# Altium project 243-TGE-Template.PrjPcb
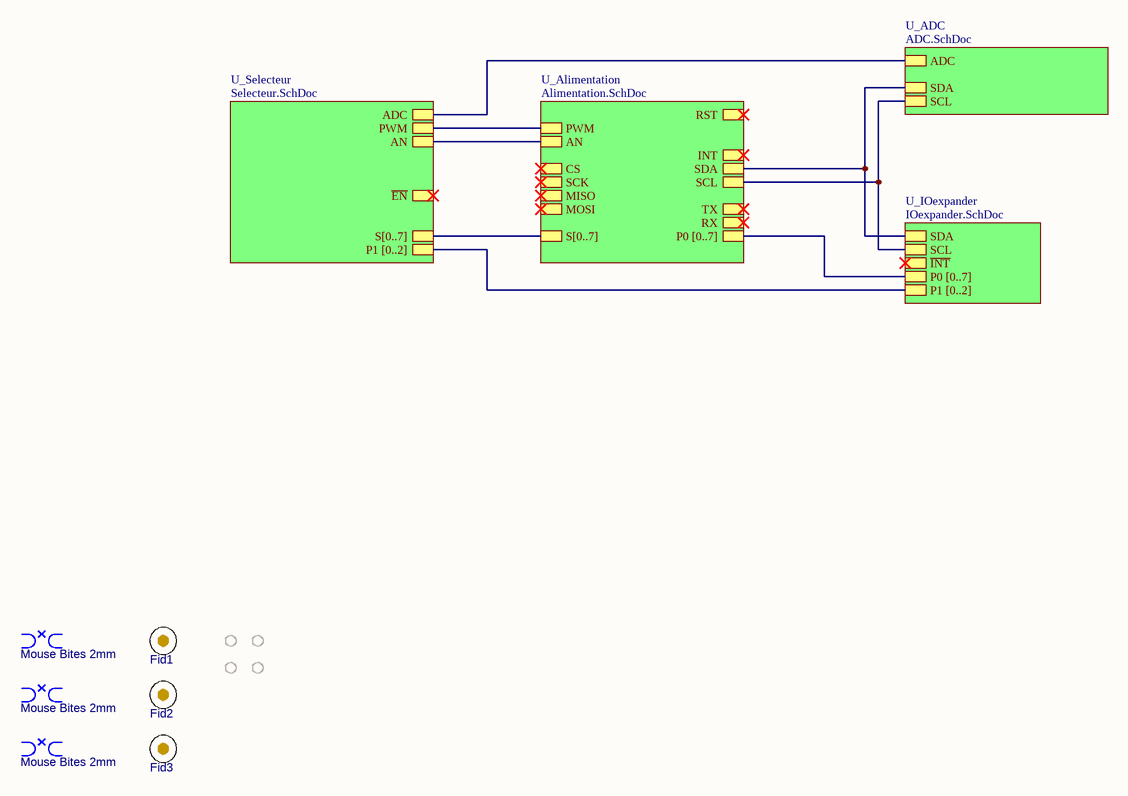
[diagram p0: Page_Tete.SchDoc]
NomDeLetudiant: Le nom de l'étudiant; NomDeProjet: Le nom de mon Projet; Revision: La Revision
5 sheets, 52 parts. Net scope: hierarchical (ports join the sheet entries above them; power ports are global).
Board file: ClickBoard.PcbDoc
Sheets:
  Page_Tete.SchDoc
    U_ADC = ADC.SchDoc
    U_Alimentation = Alimentation.SchDoc
    U_Selecteur = Selecteur.SchDoc
    U_IOexpander = IOexpander.SchDoc

## Sheet Page_Tete.SchDoc: ClickBoard - Page Tête
size Letter; ApprovedBy: K.C.; Author: Antoine Perron; Organization: Cegep Limoilou; Address1: 1300, 8e Avenue; Address2: Québec, QC; Address3: Canada; Address4: G1J 5L5; Revision: B2; SheetNumber: 1; SheetTotal: 5

### Parts
BRK1  value Mouse Bites 2mm  [BK_CRACK1B_M]  (hidden comment: DNP)  (no BOM)
BRK2  value Mouse Bites 2mm  [BK_CRACK1B_M]  (hidden comment: DNP)  (no BOM)
BRK3  value Mouse Bites 2mm  [BK_CRACK1B_M]  (hidden comment: DNP)  (no BOM)
Fid1  DNP  [FD_Fiducial]  (value not drawn)  (no BOM)
Fid2  DNP  [FD_Fiducial]  (value not drawn)  (no BOM)
Fid3  DNP  [FD_Fiducial]  (value not drawn)  (no BOM)
MH1  DNP  [MP_M-Hole_M2-NonPlated]  (value not drawn)  (no BOM)
MH2  DNP  [MP_M-Hole_M2-NonPlated]  (value not drawn)  (no BOM)
MH3  DNP  [MP_M-Hole_M2-NonPlated]  (value not drawn)  (no BOM)
MH4  DNP  [MP_M-Hole_M2-NonPlated]  (value not drawn)  (no BOM)

### Sub-sheets
U_ADC = ADC.SchDoc: SCL, SDA, ADC
U_Alimentation = Alimentation.SchDoc: SDA, SCL, S[0..7], P0 [0..7], MOSI, MISO, SCK, RST, PWM, CS, AN, RX, TX, INT
U_IOexpander = IOexpander.SchDoc: SDA, SCL, ~{INT}, P0 [0..7], P1 [0..2]
U_Selecteur = Selecteur.SchDoc: ADC, ~{EN}, PWM, P1 [0..2], S[0..7], AN

### Nets
ADC: sheet U_ADC/ADC, sheet U_Selecteur/ADC
AN: sheet U_Alimentation/AN, sheet U_Selecteur/AN
PWM: sheet U_Alimentation/PWM, sheet U_Selecteur/PWM
SCL: sheet U_ADC/SCL, sheet U_Alimentation/SCL, sheet U_IOexpander/SCL
SDA: sheet U_ADC/SDA, sheet U_Alimentation/SDA, sheet U_IOexpander/SDA

Not connected (* = marked no-connect by the designer): BRK1 1 2 3 4 5; BRK2 1 2 3 4 5; BRK3 1 2 3 4 5; Fid1 1 2 3 4 5; Fid2 1 2 3 4 5; Fid3 1 2 3 4 5

### Buses and harness runs
bus sheet U_Alimentation/P0 [0..7] = sheet U_IOexpander/P0 [0..7]
bus sheet U_Alimentation/S[0..7] = sheet U_Selecteur/S[0..7]
bus sheet U_IOexpander/P1 [0..2] = sheet U_Selecteur/P1 [0..2]

### Notes on the sheet
- Titre :
- Conception :
- Date :
- Approbation :
- Heure :
- Révision :
- Feuille
- de
- Fichier :

### Library data of the parts
BRK1-BRK3 = BK_BREAKOUT_2MM: Mouse Bites; Mounting Technology: N/A
Fid1-Fid3 = Fiducial: Fiducial mark for alignement and Pick&Place; Value: Fiducial mark; Mounting Technology: N/A
MH1-MH4 = MH-2MM_NP: Mounting Hole 2mm non plated; Manufacturer Part Number 1: DNP; Mounting Technology: N/A; Value: Mounting Hole 2mm non plated; Supplier Part Number 1: N/A

## Sheet ADC.SchDoc: ClickBoard - ADC
size Letter; ApprovedBy: K.C.; Author: Antoine Perron; Organization: Cegep Limoilou; Address1: 1300, 8e Avenue; Address2: Québec, QC; Address3: Canada; Address4: G1J 5L5; Revision: B3; SheetNumber: 3; SheetTotal: 5
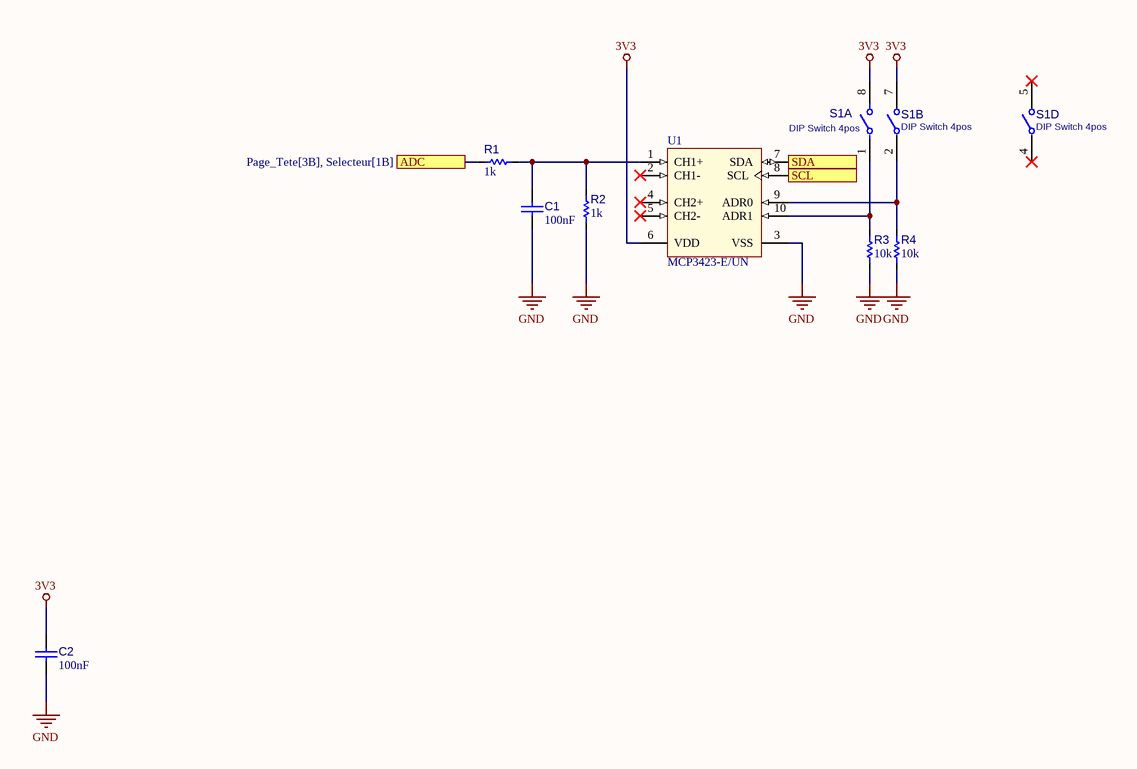
[diagram p1: ADC.SchDoc]

### Parts
C1  value 100nF  [C_1608[0603]]  (hidden comment: CAP CER 100nF 50V 0603)
C2  value 100nF  [C_1608[0603]]  (hidden comment: CAP CER 100nF 50V 0603)
R1  value 1k  [R_1608[0603]]  (hidden comment: Res 1k 1% 0603)
R2  value 1k  [R_1608[0603]]  (hidden comment: Res 1k 1% 0603)
R3  value 10k  [R_1608[0603]]  (hidden comment: Res 10k 1% 0603)
R4  value 10k  [R_1608[0603]]  (hidden comment: Res 10k 1% 0603)
S1  value DIP Switch 4pos  [S_DIP_SWITCH_50MIL_4POS]  (hidden comment: DSHP04TSGER)  (parts A,B,D of 4)
U1  MCP3423-E/UN  [U_MSOP50P300X500-10(RM-10)_WO-TP]

### Ports
ADC (see Page_Tete[3B], Selecteur[1B]), SCL (see Page_Tete[3B], Alimentation[4B], IOexpander[2B]), SDA (see Page_Tete[3B], Alimentation[4B], IOexpander[2B])

### Nets
3V3: C2.2 S1.7 S1.8 U1.6(VDD)
GND: C1.1 C2.1 R2.1 R3.1 R4.1 U1.3(VSS)
ADC: R1.1 ; port ADC
SCL: U1.8(SCL) ; port SCL
SDA: U1.7(SDA) ; port SDA
NetC1_2: C1.2 R1.2 R2.2 U1.1(CH1+)
NetR3_2: R3.2 S1.1 U1.10(ADR1)
NetR4_2: R4.2 S1.2 U1.9(ADR0)

Not connected (* = marked no-connect by the designer): S1 4* 5*; U1 2(CH1-)* 4(CH2+)* 5(CH2-)*

### Notes on the sheet
- Titre :
- Conception :
- Date :
- Approbation :
- Heure :
- Révision :
- Feuille
- de
- Fichier :

### Library data of the parts
C1 C2 = CAP002: Capacitor type 1; Manufacturer 1: Yageo; Manufacturer Part Number 1: CC0603KRX7R9BB104; LibRef: CAP002; Code CEGEP: COND0143SM; Tolerance: 10%; Dielectric: X7R; Rated Voltage: 50V; Mounting Technology: SMT; Supplier 1: LCSC; Supplier Part Number 1: C14663
R1 R2 = RES015: Resistor type 1; Manufacturer 1: Yageo; Manufacturer Part Number 1: RC0603FR-071KL; LibRef: RES015; Puissance: 1/10W; Max Working Voltage: 75V; Tolerance: 1%; Mounting Technology: SMT; Supplier 1: LCSC; Supplier Part Number 1: C22548
R3 R4 = RES001: Resistor type 1; Manufacturer 1: Yageo; Manufacturer Part Number 1: RC0603FR-0710KL; LibRef: RES001; Code CEGEP: RESI0238-0603; Puissance: 1/10W; Max Working Voltage: 75V; Tolerance: 1%; Mounting Technology: SMT; Supplier 1: LCSC; Supplier Part Number 1: C98220
S1 = SW_DIP_50MIL_4POS: SWITCH DIP SLIDE SPST 25MA 24V, pitch 1.27mm, height 1.55mm; Manufacturer 1: kangshen; Manufacturer 2: Omron; Manufacturer Part Number 1: DSHP04TSGER; Manufacturer Part Number 2: A6H-4102-PM; Mounting Technology: SMT; Supplier 1: LCSC; Supplier 2: LCSC; Supplier Part Number 1: C3293144; Supplier Part Number 2: C2733274; Supplier 3: Digikey; Supplier Part Number 3: 39-A6H-4102-PMCT-ND
U1 = U_MCP3423-E/UN: CAN Controller Stand-Alone With SPI, 18-Pin PDIP; Manufacturer 1: Microchip; Manufacturer Part Number 1: MCP3423-E/UN; Supplier 1: LCSC; Supplier Part Number 1: C220864; Mounting Technology: SMT; Supplier 2: Digikey; Supplier Part Number 2: MCP3423-E/UN-ND

## Sheet Alimentation.SchDoc: ClickBoard - Alimentation
size Letter; ApprovedBy: K.C.; Author: Antoine Perron; Organization: Cegep Limoilou; Address1: 1300, 8e Avenue; Address2: Québec, QC; Address3: Canada; Address4: G1J 5L5; Revision: B3; SheetNumber: 2; SheetTotal: 5
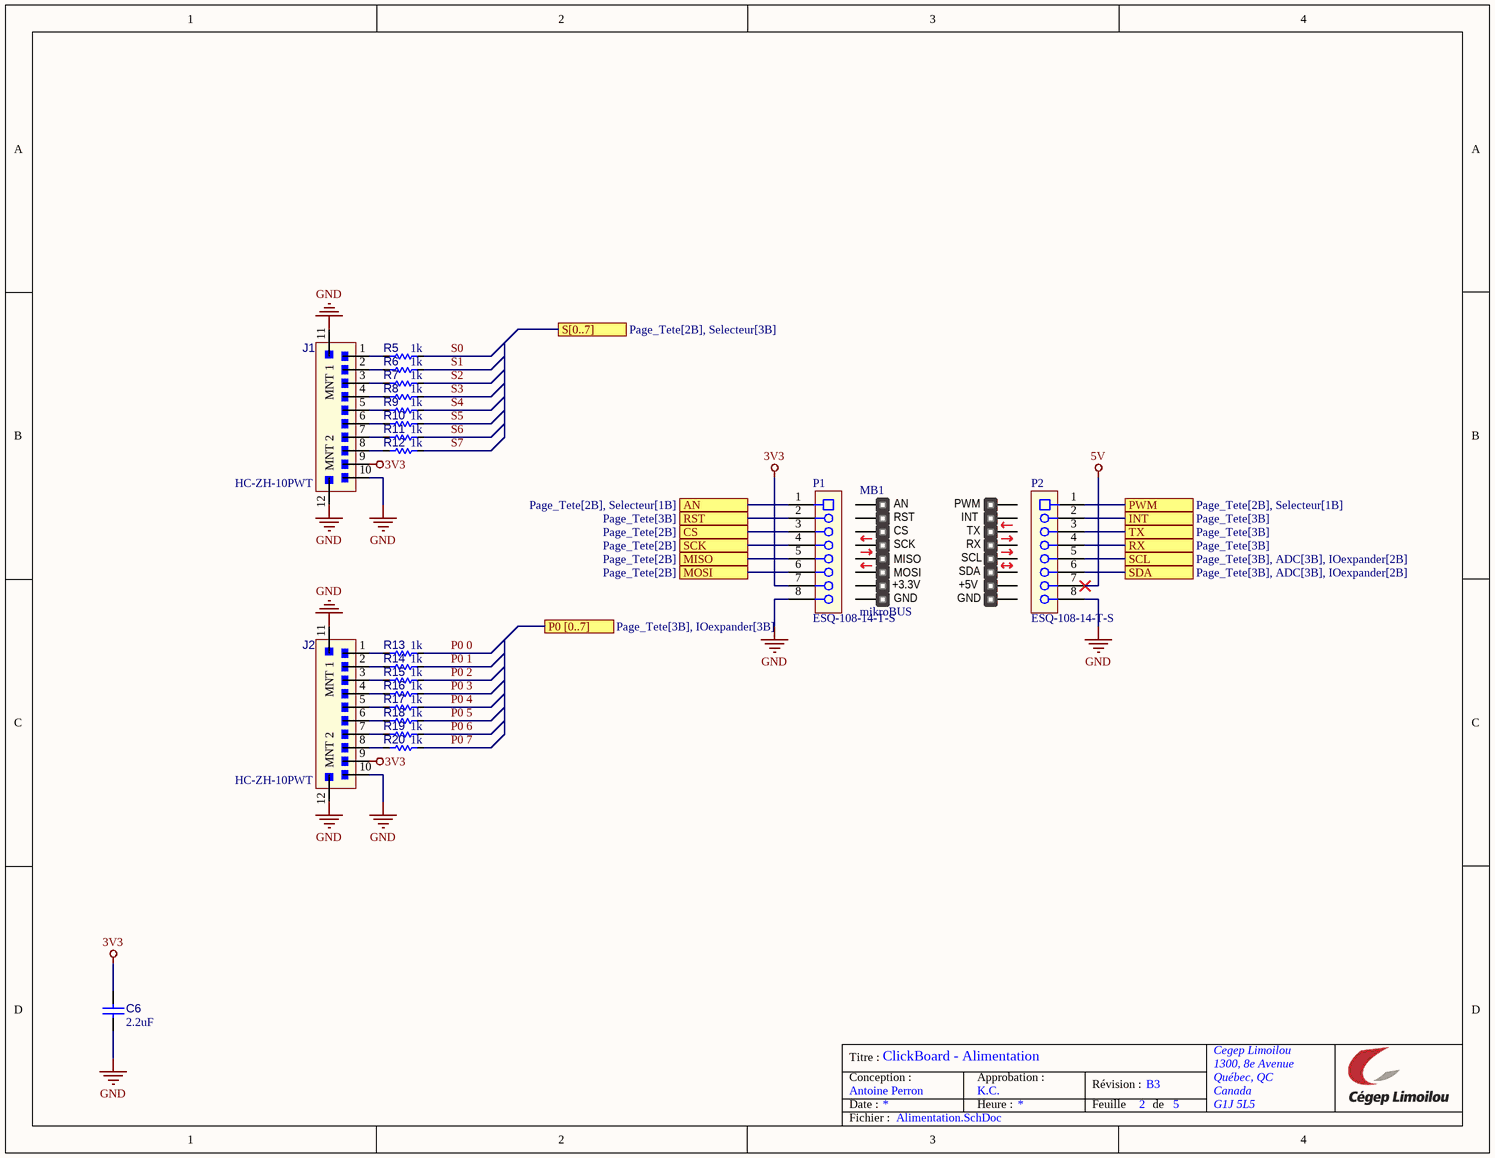
[diagram p2: Alimentation.SchDoc]

### Parts
C6  value 2.2uF  [C_1608[0603]]  (hidden comment: CAP CER 2.2uF 10V X7R 0603)
J1  HC-ZH-10PWT  [J_S10B-ZR-SM4]
J2  HC-ZH-10PWT  [J_S10B-ZR-SM4]
MB1  mikroBUS  [mikroBUS-Large-No-Connector]  (no BOM)
P1  ESQ-108-14-T-S  [CONN_SKT_01X08_100MIL-ELEVATED-LONGPIN]
P2  ESQ-108-14-T-S  [CONN_SKT_01X08_100MIL-ELEVATED-LONGPIN]
R5  value 1k  [R_1608[0603]]  (hidden comment: Res 1k 1% 0603)
R6  value 1k  [R_1608[0603]]  (hidden comment: Res 1k 1% 0603)
R7  value 1k  [R_1608[0603]]  (hidden comment: Res 1k 1% 0603)
R8  value 1k  [R_1608[0603]]  (hidden comment: Res 1k 1% 0603)
R9  value 1k  [R_1608[0603]]  (hidden comment: Res 1k 1% 0603)
R10  value 1k  [R_1608[0603]]  (hidden comment: Res 1k 1% 0603)
R11  value 1k  [R_1608[0603]]  (hidden comment: Res 1k 1% 0603)
R12  value 1k  [R_1608[0603]]  (hidden comment: Res 1k 1% 0603)
R13  value 1k  [R_1608[0603]]  (hidden comment: Res 1k 1% 0603)
R14  value 1k  [R_1608[0603]]  (hidden comment: Res 1k 1% 0603)
R15  value 1k  [R_1608[0603]]  (hidden comment: Res 1k 1% 0603)
R16  value 1k  [R_1608[0603]]  (hidden comment: Res 1k 1% 0603)
R17  value 1k  [R_1608[0603]]  (hidden comment: Res 1k 1% 0603)
R18  value 1k  [R_1608[0603]]  (hidden comment: Res 1k 1% 0603)
R19  value 1k  [R_1608[0603]]  (hidden comment: Res 1k 1% 0603)
R20  value 1k  [R_1608[0603]]  (hidden comment: Res 1k 1% 0603)

### Ports
AN (see Page_Tete[2B], Selecteur[1B]), CS (see Page_Tete[2B]), INT (see Page_Tete[3B]), MISO (see Page_Tete[2B]), MOSI (see Page_Tete[2B]), P0 [0..7] (see Page_Tete[3B], IOexpander[3B]), PWM (see Page_Tete[2B], Selecteur[1B]), RST (see Page_Tete[3B]), RX (see Page_Tete[3B]), S[0..7] (see Page_Tete[2B], Selecteur[3B]), SCK (see Page_Tete[2B]), SCL (see Page_Tete[3B], ADC[3B], IOexpander[2B]), SDA (see Page_Tete[3B], ADC[3B], IOexpander[2B]), TX (see Page_Tete[3B])

### Nets
3V3: C6.2 J1.9 J2.9 P1.7
5V: P2.7
GND: C6.1 J1.10 J1.11(MNT_1) J1.12(MNT_2) J2.10 J2.11(MNT_1) J2.12(MNT_2) P1.8 P2.8
AN: P1.1 ; port AN
CS: P1.3 ; port CS
INT: P2.2 ; port INT
MISO: P1.5 ; port MISO
MOSI: P1.6 ; port MOSI
P0 0: R13.2  [project net P0 0_2]
P0 1: R14.2  [project net P0 1_2]
P0 2: R15.2  [project net P0 2_2]
P0 3: R16.2  [project net P0 3_2]
P0 4: R17.2  [project net P0 4_2]
P0 5: R18.2  [project net P0 5_2]
P0 6: R19.2  [project net P0 6_2]
P0 7: R20.2  [project net P0 7_2]
PWM: P2.1 ; port PWM
RST: P1.2 ; port RST
RX: P2.4 ; port RX
S0: R5.2  [project net S0_2]
S1: R6.2  [project net S1_2]
S2: R7.2  [project net S2_2]
S3: R8.2  [project net S3_2]
S4: R9.2  [project net S4_2]
S5: R10.2  [project net S5_2]
S6: R11.2  [project net S6_2]
S7: R12.2  [project net S7_2]
SCK: P1.4 ; port SCK
SCL: P2.5 ; port SCL
SDA: P2.6 ; port SDA
TX: P2.3 ; port TX
NetJ1_1: J1.1 R5.1
NetJ1_2: J1.2 R6.1
NetJ1_3: J1.3 R7.1
NetJ1_4: J1.4 R8.1
NetJ1_5: J1.5 R9.1
NetJ1_6: J1.6 R10.1
NetJ1_7: J1.7 R11.1
NetJ1_8: J1.8 R12.1
NetJ2_1: J2.1 R13.1
NetJ2_2: J2.2 R14.1
NetJ2_3: J2.3 R15.1
NetJ2_4: J2.4 R16.1
NetJ2_5: J2.5 R17.1
NetJ2_6: J2.6 R18.1
NetJ2_7: J2.7 R19.1
NetJ2_8: J2.8 R20.1

Not connected (* = marked no-connect by the designer): MB1 1(AN) 2(RST) 3(CS) 4(SCK) 5(MISO) 6(MOSI) 7(3.3V) 8(GND) 9(GND) 10(5V) 11(SDA) 12(SCL) 13(TX) 14(RX) 15(INT) 16(PWM)

### Notes on the sheet
- Titre :
- Conception :
- Date :
- Approbation :
- Heure :
- Révision :
- Feuille
- de
- Fichier :
- (in symbol mikroBUS compatible add-on board) +3.3V; +5V

### Library data of the parts
C6 = CAP022: Capacitor type 1; Manufacturer 1: Samsung; Manufacturer Part Number 1: CL10B225KP8NNNC; LibRef: CAP022; Tolerance: 10%; Rated Voltage: 10V; Dielectric: X7R; Mounting Technology: SMT; Supplier 1: LCSC; Supplier Part Number 1: C100082
J1 J2 = CONN-1MM5-01X10-S10B-H-SMT: CONN wire to board SMT R/A 10POS 1.5mm; Manufacturer 1: HCTL; Manufacturer Part Number 1: HC-ZH-10PWT; Manufacturer 2: JST; Manufacturer Part Number 2: S10B-ZR-SM4A-TF(LF)(SN); Mounting Technology: SMT; Supplier 1: LCSC; Supplier 2: LCSC; Supplier Part Number 1: C2845432; Supplier Part Number 2: C5149249; Supplier 3: Digikey; Supplier Part Number 3: 455-1700-1-ND
MB1 = mikroBUS compatible add-on board
P1 P2 = CONN-100MIL-SKT-01X08_ELEVATED_LONGPIN: CONN SOCKET 8pos 100mils Elevated; Manufacturer 1: Samtec; Mounting Technology: TH; Manufacturer Part Number 1: ESQ-108-14-T-S; Supplier 1: Digikey; Supplier Part Number 1: SAM9303-ND
R5-R20 = RES015: as R1 on sheet ADC; Tolerance: 1%; Mounting Technology: SMT; Supplier 1: LCSC; Supplier Part Number 1: C22548

## Sheet Selecteur.SchDoc: ClickBoard - Sélecteur
size Letter; ApprovedBy: K.C.; Author: Antoine Perron; Organization: Cegep Limoilou; Address1: 1300, 8e Avenue; Address2: Québec, QC; Address3: Canada; Address4: G1J 5L5; Revision: B3; SheetNumber: 4; SheetTotal: 5
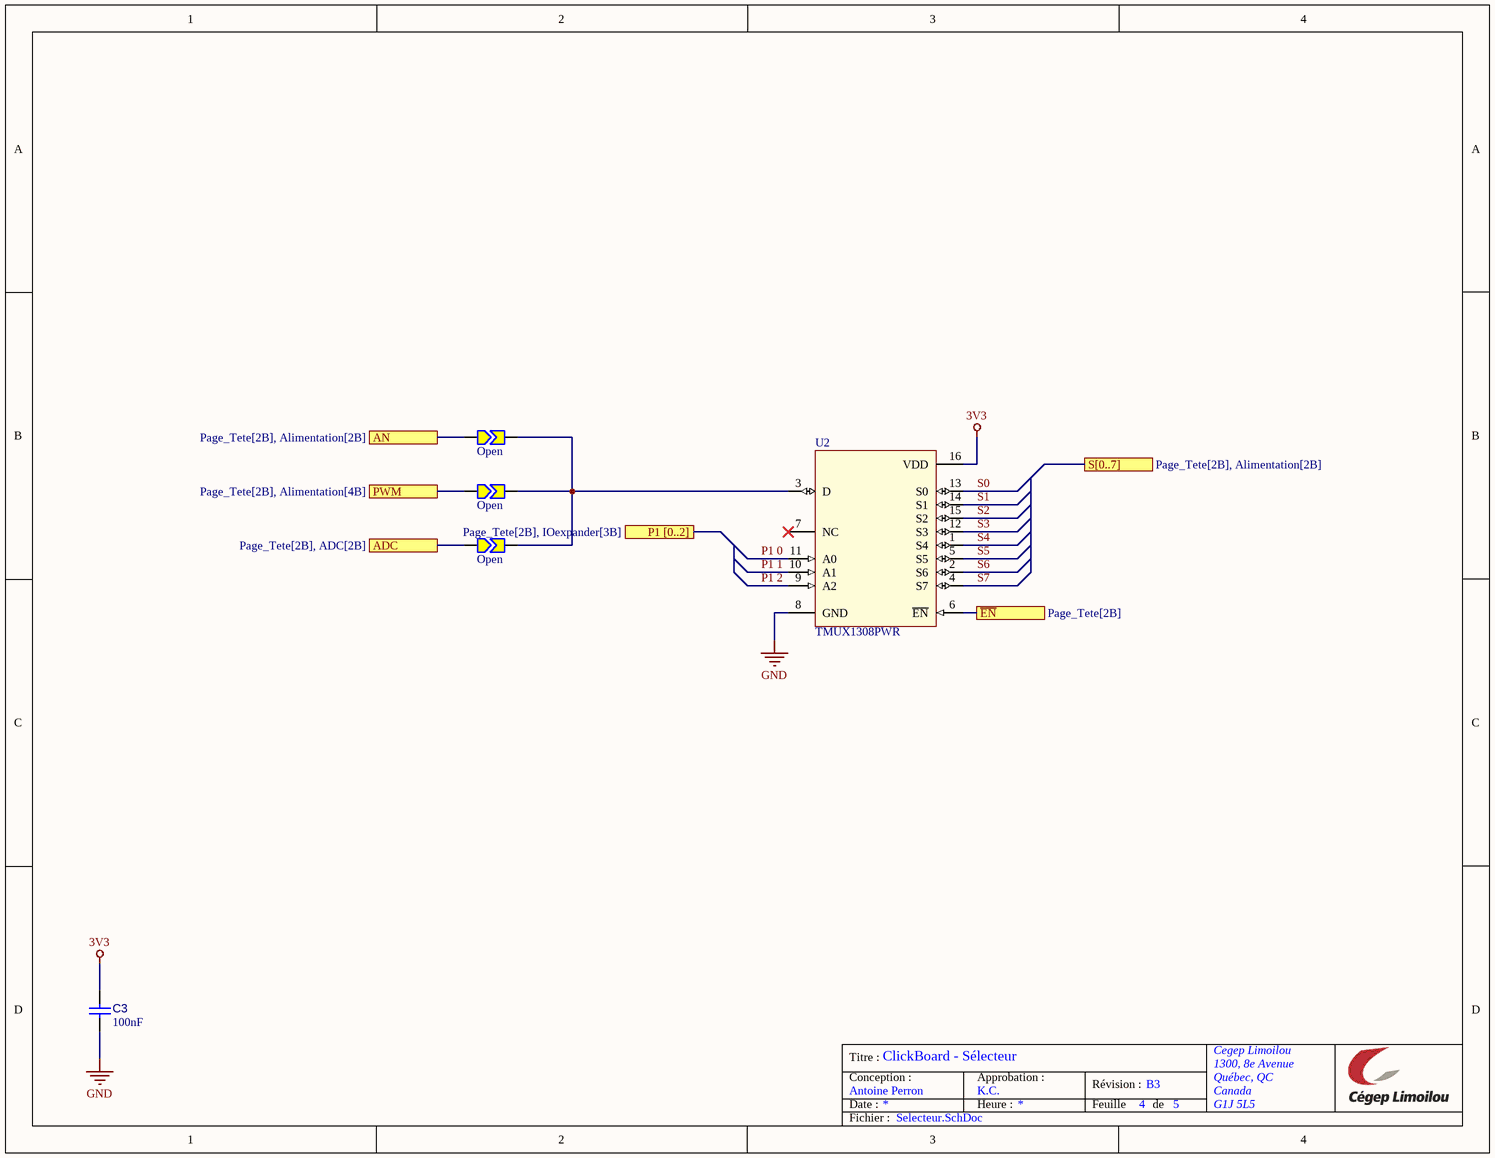
[diagram p3: Selecteur.SchDoc]

### Parts
C3  value 100nF  [C_1608[0603]]  (hidden comment: CAP CER 100nF 50V 0603)
SB1  Open  [SB-TINY-OPEN]  (no BOM)
SB2  Open  [SB-TINY-OPEN]  (no BOM)
SB3  Open  [SB-TINY-OPEN]  (no BOM)
U2  TMUX1308PWR  [U_TSSOP65P500X450-16]

### Ports
ADC (see Page_Tete[2B], ADC[2B]), AN (see Page_Tete[2B], Alimentation[2B]), P1 [0..2] (see Page_Tete[2B], IOexpander[3B]), PWM (see Page_Tete[2B], Alimentation[4B]), S[0..7] (see Page_Tete[2B], Alimentation[2B]), ~{EN} (see Page_Tete[2B])

### Nets
3V3: C3.2 U2.16(VDD)
GND: C3.1 U2.8(GND)
ADC: SB3.1 ; port ADC
AN: SB1.1 ; port AN
~{EN}: U2.6(~{EN}) ; port ~{EN}
P1 0: U2.11(A0)  [project net P1 0_4]
P1 1: U2.10(A1)  [project net P1 1_4]
P1 2: U2.9(A2)  [project net P1 2_4]
PWM: SB2.1 ; port PWM
S0: U2.13(S0)  [project net S0_4]
S1: U2.14(S1)  [project net S1_4]
S2: U2.15(S2)  [project net S2_4]
S3: U2.12(S3)  [project net S3_4]
S4: U2.1(S4)  [project net S4_4]
S5: U2.5(S5)  [project net S5_4]
S6: U2.2(S6)  [project net S6_4]
S7: U2.4(S7)  [project net S7_4]
NetSB1_2: SB1.2 SB2.2 SB3.2 U2.3(D)

Not connected (* = marked no-connect by the designer): U2 7(NC)*

### Notes on the sheet
- Titre :
- Conception :
- Date :
- Approbation :
- Heure :
- Révision :
- Feuille
- de
- Fichier :

### Library data of the parts
C3 = CAP002: as C1 on sheet ADC; Rated Voltage: 50V; Mounting Technology: SMT; Supplier 1: LCSC; Supplier Part Number 1: C14663
SB1-SB3 = Solder-Jumper-Open: Solder Jumper
U2 = U_TMUX1308PWR: IC MUX 8:1 195OHM 16TSSOP; Manufacturer 1: TI; Manufacturer Part Number 1: TMUX1308PWR; Mounting Technology: SMT; Supplier 1: LCSC; Supplier 2: Digikey; Supplier Part Number 1: C970231; Supplier Part Number 2: 296-TMUX1308PWRCT-ND

## Sheet IOexpander.SchDoc: ClickBoard - IO
size Letter; ApprovedBy: K.C.; Author: Antoine Perron; Organization: Cegep Limoilou; Address1: 1300, 8e Avenue; Address2: Québec, QC; Address3: Canada; Address4: G1J 5L5; Revision: B3; SheetNumber: 5; SheetTotal: 5
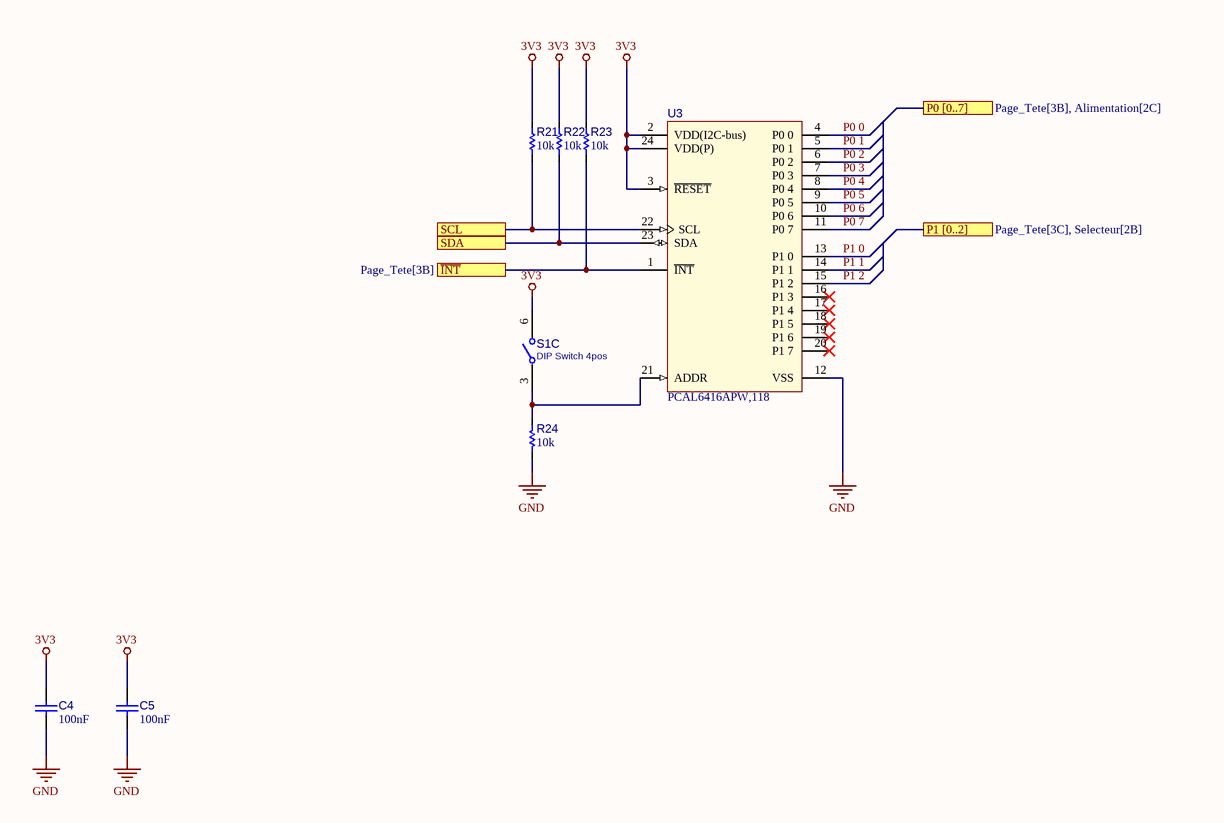
[diagram p4: IOexpander.SchDoc]

### Parts
C4  value 100nF  [C_1608[0603]]  (hidden comment: CAP CER 100nF 50V 0603)
C5  value 100nF  [C_1608[0603]]  (hidden comment: CAP CER 100nF 50V 0603)
R21  value 10k  [R_1608[0603]]  (hidden comment: Res 10k 1% 0603)
R22  value 10k  [R_1608[0603]]  (hidden comment: Res 10k 1% 0603)
R23  value 10k  [R_1608[0603]]  (hidden comment: Res 10k 1% 0603)
R24  value 10k  [R_1608[0603]]  (hidden comment: Res 10k 1% 0603)
S1  value DIP Switch 4pos  [S_DIP_SWITCH_50MIL_4POS]  (hidden comment: DSHP04TSGER)  (part C of 4)
U3  PCAL6416APW,118  [U_TSSOP24_SOT355-1-IPC_B]

### Ports
P0 [0..7] (see Page_Tete[3B], Alimentation[2C]), P1 [0..2] (see Page_Tete[3C], Selecteur[2B]), SCL (see Page_Tete[3B], ADC[3B], Alimentation[4B]), SDA (see Page_Tete[3B], ADC[3B], Alimentation[4B]), ~{INT} (see Page_Tete[3B])

### Nets
3V3: C4.2 C5.2 R21.2 R22.2 R23.2 S1.6 U3.2(VDD(I2C-bus)) U3.3(~{RESET}) U3.24(VDD(P))
GND: C4.1 C5.1 R24.1 U3.12(VSS)
~{INT}: R23.1 U3.1(~{INT}) ; port ~{INT}
P0 0: U3.4(P0_0)  [project net P0 0_5]
P0 1: U3.5(P0_1)  [project net P0 1_5]
P0 2: U3.6(P0_2)  [project net P0 2_5]
P0 3: U3.7(P0_3)  [project net P0 3_5]
P0 4: U3.8(P0_4)  [project net P0 4_5]
P0 5: U3.9(P0_5)  [project net P0 5_5]
P0 6: U3.10(P0_6)  [project net P0 6_5]
P0 7: U3.11(P0_7)  [project net P0 7_5]
P1 0: U3.13(P1_0)  [project net P1 0_5]
P1 1: U3.14(P1_1)  [project net P1 1_5]
P1 2: U3.15(P1_2)  [project net P1 2_5]
SCL: R21.1 U3.22(SCL) ; port SCL
SDA: R22.1 U3.23(SDA) ; port SDA
NetR24_2: R24.2 S1.3 U3.21(ADDR)

Not connected (* = marked no-connect by the designer): U3 16(P1_3)* 17(P1_4)* 18(P1_5)* 19(P1_6)* 20(P1_7)*

### Notes on the sheet
- Titre :
- Conception :
- Date :
- Approbation :
- Heure :
- Révision :
- Feuille
- de
- Fichier :

### Library data of the parts
C4 C5 = CAP002: as C1 on sheet ADC; Rated Voltage: 50V; Mounting Technology: SMT; Supplier 1: LCSC; Supplier Part Number 1: C14663
R21-R24 = RES001: as R3 on sheet ADC; Tolerance: 1%; Mounting Technology: SMT; Supplier 1: LCSC; Supplier Part Number 1: C98220
S1 = SW_DIP_50MIL_4POS: as S1 on sheet ADC; Manufacturer 2: Omron; Manufacturer Part Number 1: DSHP04TSGER; Manufacturer Part Number 2: A6H-4102-PM; Mounting Technology: SMT; Supplier 1: LCSC; Supplier 2: LCSC; Supplier Part Number 1: C3293144; Supplier Part Number 2: C2733274; Supplier 3: Digikey; Supplier Part Number 3: 39-A6H-4102-PMCT-ND
U3 = U_PCAL6416APW: IC I/O EXPANDER 16BIT 24TSSOP; Manufacturer Part Number 1: TCA6416APWR; Manufacturer 1: Texas Instruments; Manufacturer 2: NXP Semiconductors; Manufacturer Part Number 2: PCAL6416APW,118; Mounting Technology: SMT; Supplier 1: LCSC; Supplier 2: LCSC; Supplier 3: Digikey; Supplier Part Number 1: C130203; Supplier Part Number 2: C2652299; Supplier Part Number 3: 568-9922-1-ND

## Nets that join several sheets
3V3: ADC (C2.2 S1.7 S1.8 U1.6), Alimentation (C6.2 J1.9 J2.9 P1.7), Selecteur (C3.2 U2.16), IOexpander (9 pins)
GND: ADC (6 pins), Alimentation (9 pins), Selecteur (C3.1 U2.8), IOexpander (C4.1 C5.1 R24.1 U3.12)
ADC: ADC (R1.1), Selecteur (SB3.1)
AN: Alimentation (P1.1), Selecteur (SB1.1)
PWM: Alimentation (P2.1), Selecteur (SB2.1)
SCL: ADC (U1.8), Alimentation (P2.5), IOexpander (R21.1 U3.22)
SDA: ADC (U1.7), Alimentation (P2.6), IOexpander (R22.1 U3.23)